# EAGLE design Tiny (EAGLE 8.0.1)
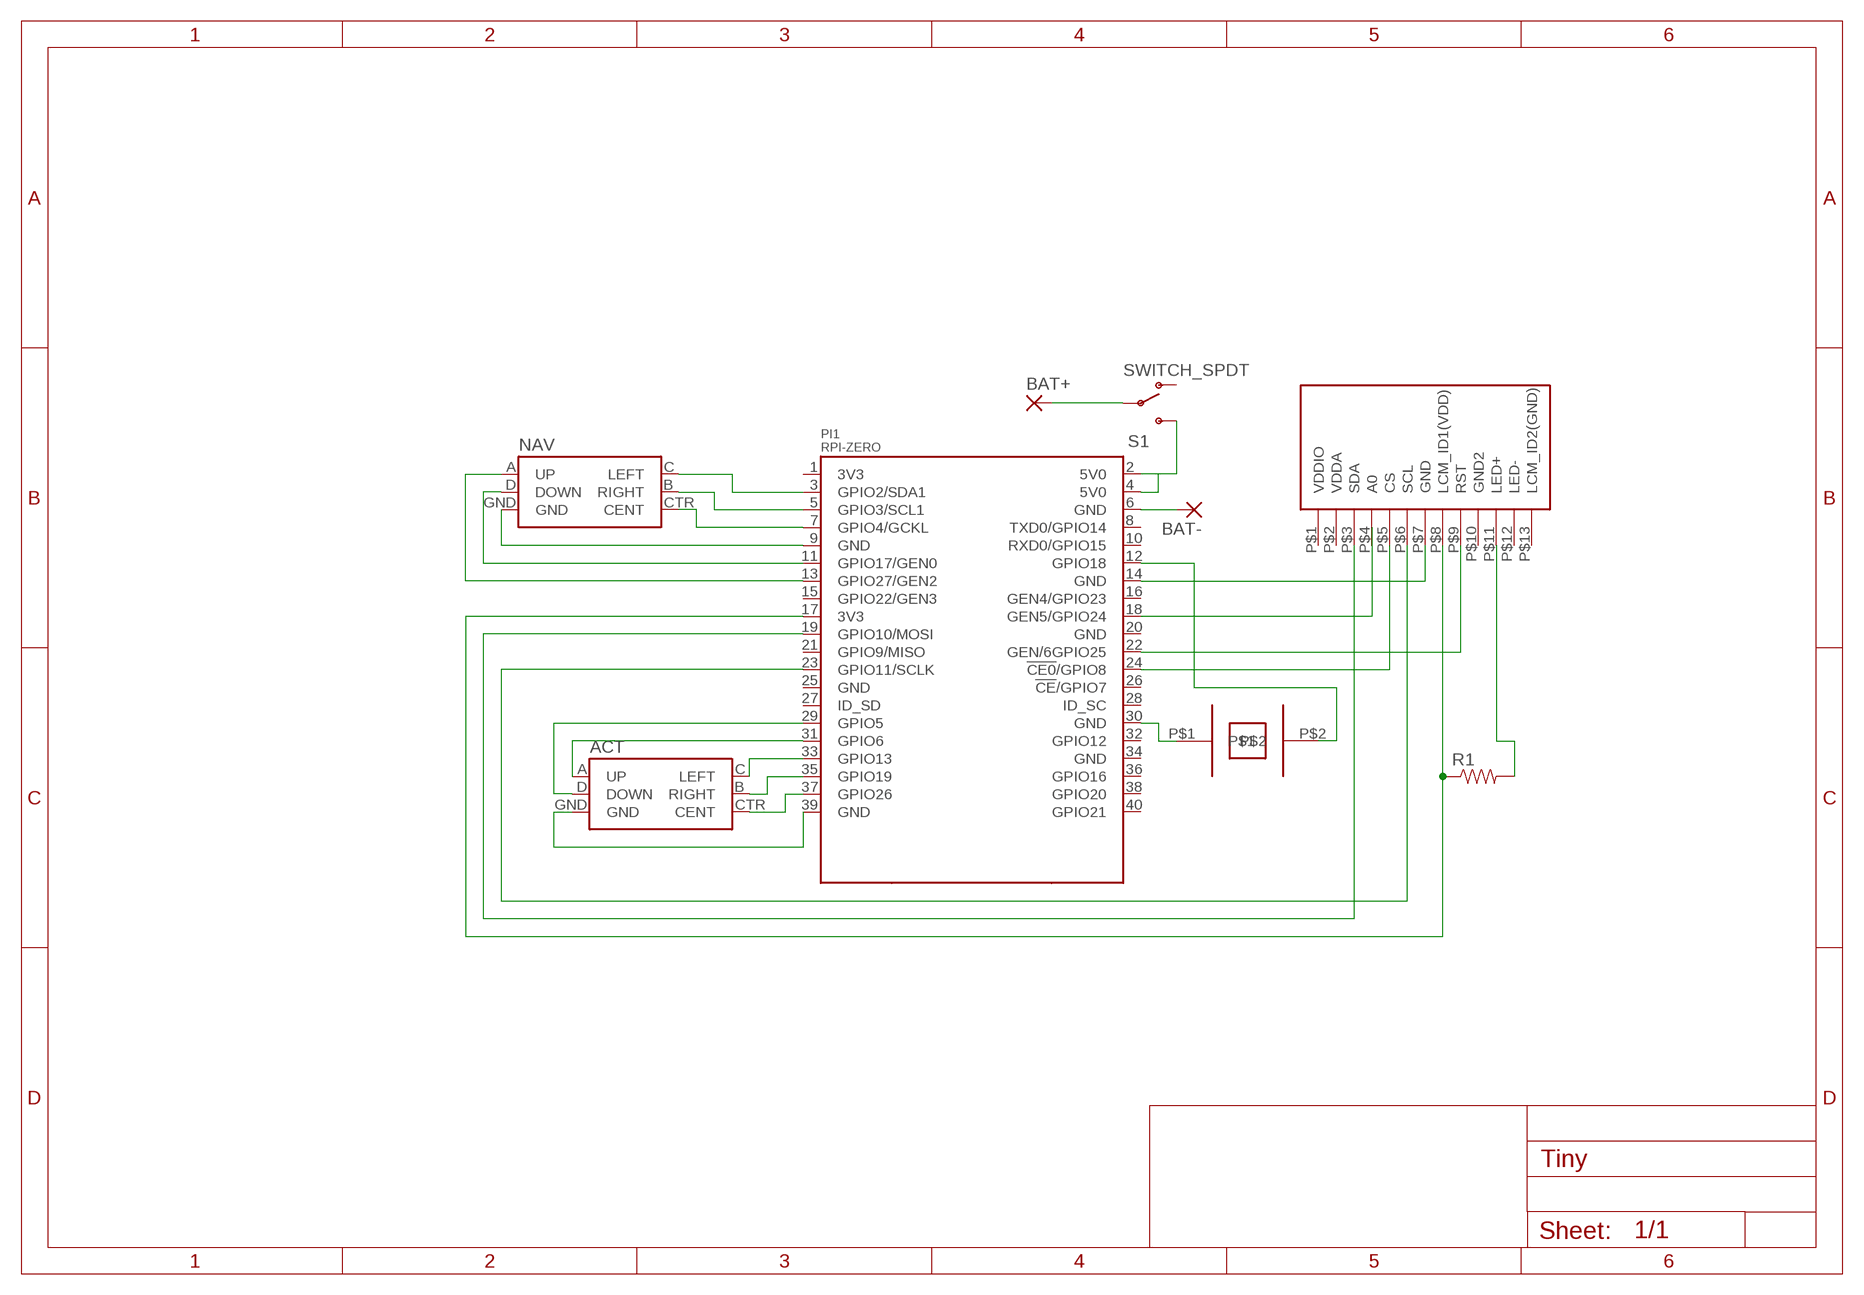
[diagram p0: schematic, sheet 1]

## Parts
ACT  JOYSTICK_MINI  [JOYSTICK_MINI]
BAT+  SMD5  [SMD2,54-5,08]
BAT-  SMD5  [SMD2,54-5,08]
NAV  JOYSTICK_MINI  [JOYSTICK_MINI]
PI1  RPI-ZERO  [RASPBERRYPI_BASTELSTUBE_V13_RASPI_BOARD_B+_FULL]
R1  RESISTOR0805-RES  [0805]
S1  SWITCH_SPDT  [KPS-1290]
U$1  ST7735S-1.44  [ST7735S-1.44]
U$2  PKLCS1212E4001  [PKLCS1212E4001]

## Nets
5V0@2: PI1.2(5V0) PI1.4(5V0) S1.S
GND@1: NAV.GND PI1.9(GND)
GND@3: ACT.GND PI1.39(GND)
GND@4: PI1.14(GND) U$1.P$7(GND)
GND@6: PI1.30(GND) U$2.P$1
GND@8: BAT-.1(P) PI1.6(GND)
N$1: PI1.22(GEN/6GPIO25) U$1.P$9(RST)
N$2: PI1.23(GPIO11/SCLK) U$1.P$6(SCL)
N$3: PI1.19(GPIO10/MOSI) U$1.P$3(SDA)
N$4: NAV.CTR(CENT) PI1.7(GPIO4/GCKL)
N$5: NAV.B(RIGHT) PI1.5(GPIO3/SCL1)
N$6: PI1.18(GEN5/GPIO24)
N$7: PI1.24(!CE0!/GPIO8) U$1.P$5(CS)
N$8: NAV.C(LEFT) PI1.3(GPIO2/SDA1)
N$9: ACT.CTR(CENT) PI1.37(GPIO26)
N$10: ACT.B(RIGHT) PI1.35(GPIO19)
N$11: ACT.C(LEFT) PI1.33(GPIO13)
N$12: ACT.A(UP) PI1.31(GPIO6)
N$13: ACT.D(DOWN) PI1.29(GPIO5)
N$14: R1.2 U$1.P$11(LED+)
N$15: NAV.D(DOWN) PI1.11(GPIO17/GEN0)
N$16: NAV.A(UP) PI1.13(GPIO27/GEN2)
N$17: PI1.12(GPIO18) U$2.P$2
N$19: PI1.17(3V3) R1.1 U$1.P$8(LCM_ID1(VDD))
N$24: BAT+.1(P) S1.P
Unconnected: PI1.1(3V3) PI1.8(TXD0/GPIO14) PI1.10(RXD0/GPIO15) PI1.15(GPIO22/GEN3) PI1.16(GEN4/GPIO23) PI1.20(GND) PI1.21(GPIO9/MISO) PI1.25(GND) PI1.26(!CE!/GPIO7) PI1.27(ID_SD) PI1.28(ID_SC) PI1.32(GPIO12) PI1.34(GND) PI1.36(GPIO16) PI1.38(GPIO20) PI1.40(GPIO21) S1.O U$1.P$1(VDDIO) U$1.P$2(VDDA) U$1.P$4(A0) U$1.P$10(GND2) U$1.P$12(LED-) U$1.P$13(LCM_ID2(GND))

## Library data of the parts
ACT NAV = SparkFun-Electromechanical:JOYSTICK_MINI: Small 5-way tactile joystick, COM-10063 4UCON SF303GJ26; PROD_ID: SWCH-09905
BAT+ BAT- = wirepad:SMD5: SMD PAD
PI1 = RPI-Zero:RPI-ZERO
R1 = SparkFun-Resistors:RESISTOR: Resistor Basic schematic elements and footprints for 0603, 1206, and PTH resistors.
S1 = SparkFun-Electromechanical:SWITCH_SPDT: SWCH-10651 Side-actuated SPDT slide switch, as used on the Arduino Pro; PROD_ID: SWCH-10651
U$1 = ST7735S:ST7735S-1.44
U$2 = PKLCS1212E4001:PKLCS1212E4001

## Board
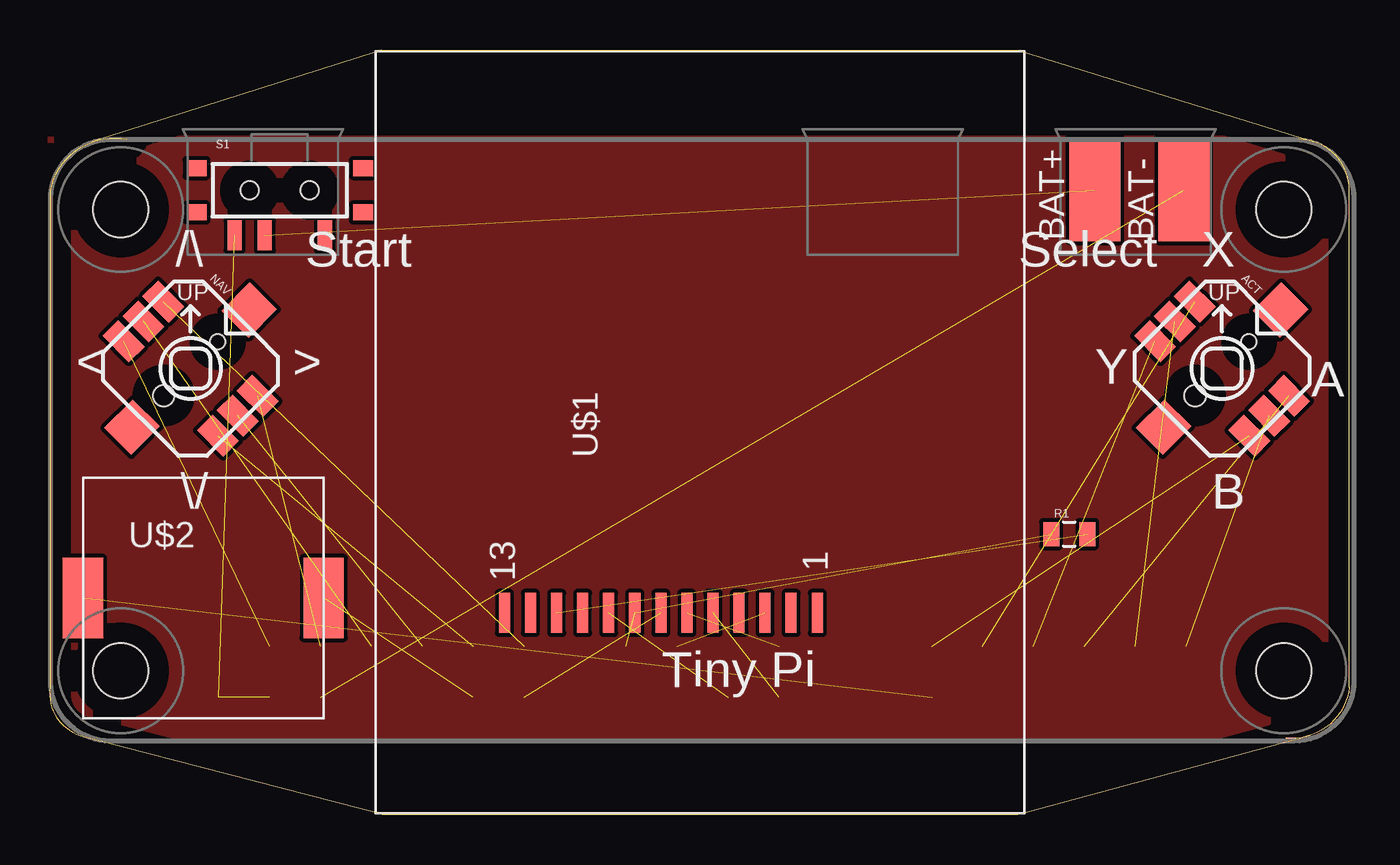
[diagram p1: board, top side]
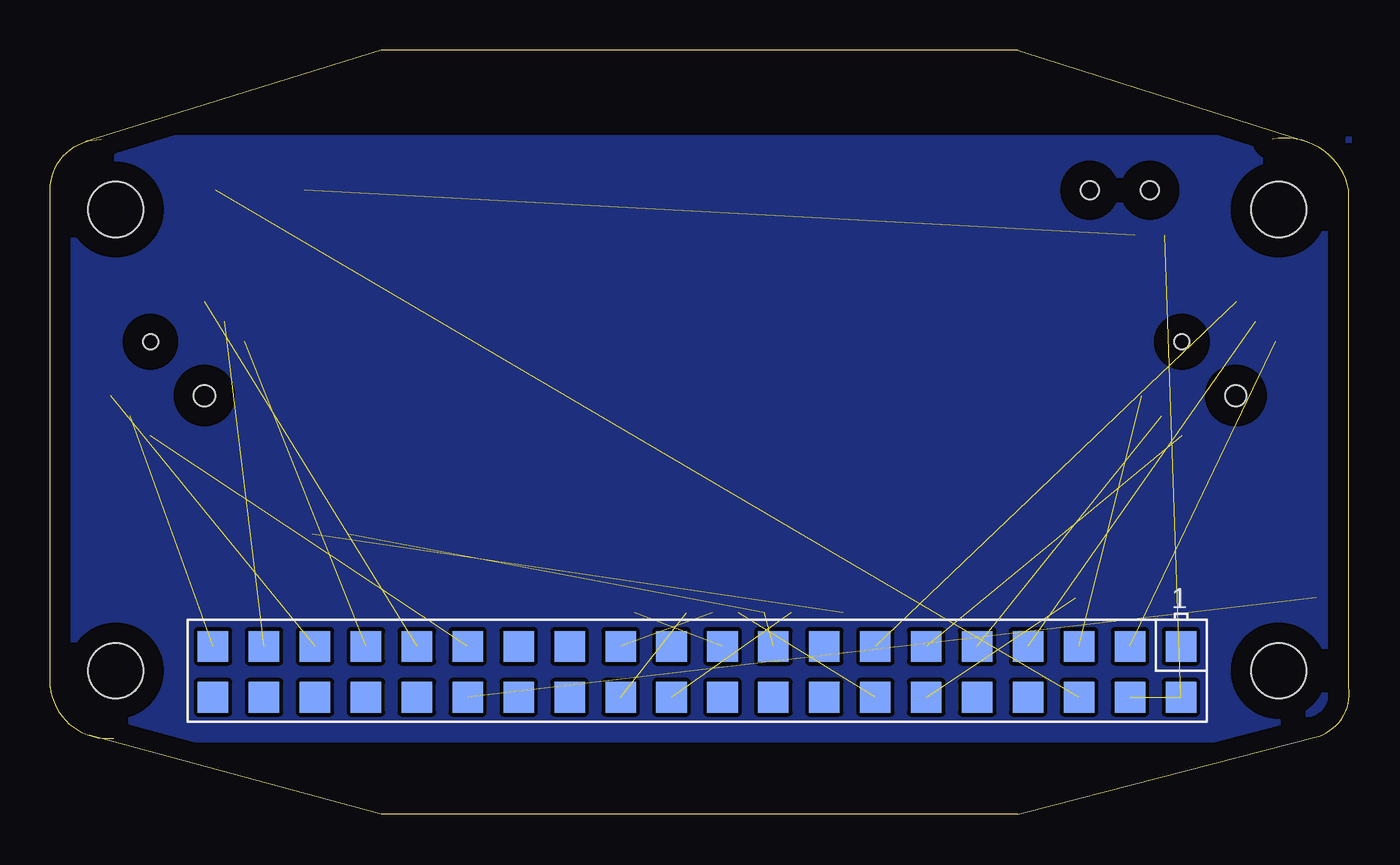
[diagram p2: board, bottom side, seen from below]

Size 64.79 x 38.1 mm. Coordinates in mm from the lower left corner, seen from the top.
Outline: 61.62,3.81 arc90 64.79,6.35 64.79,31.12 arc90 62.25,33.66
Outline: 3.83,33.66 arc90 0.02,31.12 0.02,6.35 arc90 1.93,3.81 16.53,0 48.28,0 62.83,3.94
Outline: 63.04,33.53 48.28,38.1 16.53,38.1 2.1,33.53
Copper layers (1*16): Top 0.035mm / dielectric 1.5mm / Bottom 0.035mm
Design rules "default": minimum track width 10mil, minimum drill 24mil, track to track 8mil, track to pad 8mil, pad to pad 8mil, via to via 8mil, smd to smd 8mil, copper to edge 40mil, drill to drill 8mil, minimum pad ring 10mil, minimum via ring 8mil, stop-mask expansion 4mil, vias tented up to drill 0mil, thermal gap 10mil

### Footprints (pad centres in the part's own frame; a part is rotated, then mirrored left to right if it is on the bottom)
JOYSTICK_MINI = smd 1.85 x 1.1: A -3.325,1.4; B 3.325,1.4; C -3.325,-1.4; CTR -3.325,0; D 3.325,-1.4; GND 3.325,0 | smd 1.9 x 2: NC 0,4.13; NC@0 0,-4.13 | hole 0.75: 0,1.9 | hole 1.05: 0,-1.9
SMD2,54-5,08 = smd 2.54 x 5.08: 1 0,0
RASPBERRYPI_BASTELSTUBE_V13_RASPI_BOARD_B+_FULL = smd 1.524 x 1.524: 1 8.382,25.273; 2 8.382,27.813; 3 10.922,25.273; 4 10.922,27.813; 5 13.462,25.273; 6 13.462,27.813; 7 16.002,25.273; 8 16.002,27.813; 9 18.542,25.273; 10 18.542,27.813; 11 21.082,25.273; 12 21.082,27.813; 13 23.622,25.273; 14 23.622,27.813; 15 26.162,25.273; 16 26.162,27.813; 17 28.702,25.273; 18 28.702,27.813; 19 31.242,25.273; 20 31.242,27.813; 21 33.782,25.273; 22 33.782,27.813; 23 36.322,25.273; 24 36.322,27.813; 25 38.862,25.273; 26 38.862,27.813; 27 41.402,25.273; 28 41.402,27.813; 29 43.942,25.273; 30 43.942,27.813; 31 46.482,25.273; 32 46.482,27.813; 33 49.022,25.273; 34 49.022,27.813; 35 51.562,25.273; 36 51.562,27.813; 37 54.102,25.273; 38 54.102,27.813; 39 56.642,25.273; 40 56.642,27.813 | hole 2.75: 3.5,3.5; 3.5,26.5; 61.5,3.5; 61.5,26.5
0805 = smd 0.8 x 1.2: 1 -0.9,0; 2 0.9,0
KPS-1290 = smd 0.7 x 1.5: O -2.25,2.25; P 0.75,2.25; S 2.25,2.25 | smd 1 x 0.8: P$1 -4.15,1.1; P$2 -4.15,-1.1; P$3 4.15,-1.1; P$4 4.15,1.1 | hole 0.9: -1.5,0; 1.5,0
ST7735S-1.44 = smd 2 x 0.55: P$1 -9,-5.85; P$2 -9,-4.55; P$3 -9,-3.25; P$4 -9,-1.95; P$5 -9,-0.65; P$6 -9,0.65; P$7 -9,1.95; P$8 -9,3.25; P$9 -9,4.55; P$10 -9,5.85; P$11 -9,7.15; P$12 -9,8.45; P$13 -9,9.75
PKLCS1212E4001 = smd 2 x 4: P$1 -6,0; P$2 6,0

### Placement (x,y rotation side)
ACT  58.44,22.23 315 top
BAT+  52.09,31.12 0 top
BAT-  56.54,31.12 0 top
NAV  7.01,22.23 315 top
PI1  0.02,33.66 180 bottom
R1  50.82,13.97 0 top
S1  11.45,31.12 180 top
U$1  32.41,19.05 90 top
U$2  7.64,10.79 0 top

### Tracks (layer width: path | path; a pad name or v marks a point on that pad's centre or on a via)
5V0@2  (2 unrouted)
GND@1  (1 unrouted)
GND@3  (1 unrouted)
GND@4  (1 unrouted)
GND@6  (1 unrouted)
GND@8  (1 unrouted)
N$1  (1 unrouted)
N$2  (1 unrouted)
N$3  (1 unrouted)
N$4  (1 unrouted)
N$5  (1 unrouted)
N$7  (1 unrouted)
N$8  (1 unrouted)
N$9  (1 unrouted)
N$10  (1 unrouted)
N$11  (1 unrouted)
N$12  (1 unrouted)
N$13  (1 unrouted)
N$14  (1 unrouted)
N$15  (1 unrouted)
N$16  (1 unrouted)
N$17  (1 unrouted)
N$19  (2 unrouted)
N$22
  pour Top: 0.02,3.81 0.02,33.66 64.79,33.66 64.79,3.81
N$23
  pour Bottom: 0.02,3.81 0.02,33.66 64.79,33.66 64.79,3.81
N$24  (1 unrouted)

### Text on the board
tNames: /\\ | Start | Select | X | < | > | Y | A | \\/ | B | Tiny Pi